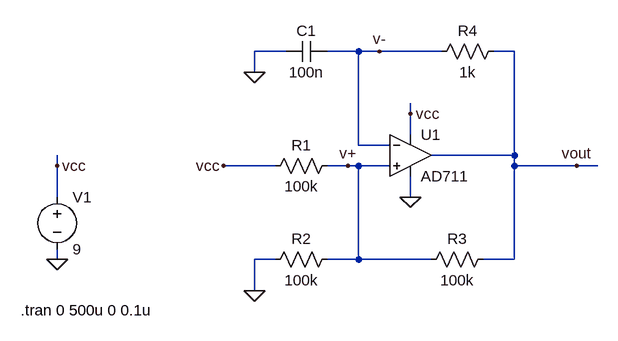
[diagram p0: schematic Relaxation Oscillator.asc]
Relaxation Oscillator.asc, the LTspice schematic file:
Version 4
SHEET 1 880 680
WIRE 336 -112 288 -112
WIRE 448 -112 400 -112
WIRE 480 -112 448 -112
WIRE 576 -112 480 -112
WIRE 688 -112 656 -112
WIRE 288 -80 288 -112
WIRE 528 -16 528 -32
WIRE 528 16 528 -16
WIRE 448 32 448 -112
WIRE 496 32 448 32
WIRE 688 48 688 -112
WIRE 688 48 560 48
WIRE -16 64 -16 48
WIRE 320 64 240 64
WIRE 432 64 400 64
WIRE 448 64 432 64
WIRE 496 64 448 64
WIRE 688 64 688 48
WIRE 784 64 688 64
WIRE 816 64 784 64
WIRE -16 112 -16 64
WIRE 528 112 528 80
WIRE -16 208 -16 192
WIRE 320 208 288 208
WIRE 448 208 448 64
WIRE 448 208 400 208
WIRE 560 208 448 208
WIRE 688 208 688 64
WIRE 688 208 640 208
WIRE 288 256 288 208
FLAG -16 208 0
FLAG -16 64 vcc
FLAG 288 -80 0
FLAG 288 256 0
FLAG 528 112 0
FLAG 528 -16 vcc
FLAG 240 64 vcc
FLAG 784 64 vout
FLAG 480 -112 v-
FLAG 432 64 v+
SYMBOL voltage -16 96 R0
WINDOW 123 0 0 Left 0
WINDOW 39 0 0 Left 0
SYMATTR InstName V1
SYMATTR Value 9
SYMBOL OpAmps\\AD711 528 -16 R0
SYMATTR InstName U1
SYMBOL res 416 48 R90
WINDOW 0 0 56 VBottom 2
WINDOW 3 32 56 VTop 2
SYMATTR InstName R1
SYMATTR Value 100k
SYMBOL res 416 192 R90
WINDOW 0 0 56 VBottom 2
WINDOW 3 32 56 VTop 2
SYMATTR InstName R2
SYMATTR Value 100k
SYMBOL res 656 192 R90
WINDOW 0 0 56 VBottom 2
WINDOW 3 32 56 VTop 2
SYMATTR InstName R3
SYMATTR Value 100k
SYMBOL res 672 -128 R90
WINDOW 0 0 56 VBottom 2
WINDOW 3 32 56 VTop 2
SYMATTR InstName R4
SYMATTR Value 1k
SYMBOL cap 400 -128 R90
WINDOW 0 0 32 VBottom 2
WINDOW 3 32 32 VTop 2
SYMATTR InstName C1
SYMATTR Value 100n
SYMATTR SpiceLine2 IC=0
TEXT -72 286 Left 2 !.tran 0 500u 0 0.1u

The netlist it stands for:
* Relaxation Oscillator.asc
V1 vcc 0 9
XU1 v+ v- vcc 0 vout AD712  ; AD711, pins In+ In- V+ V- OUT
R1 v+ vcc 100k
R2 v+ 0 100k
R3 vout v+ 100k
R4 vout v- 1k
C1 v- 0 100n IC=0
.tran 0 500u 0 0.1u
.lib ADI1.lib
.backanno
.end